# Altium schematic sheet 4v4 Power Supply.SchDoc: Power Supply
size A3
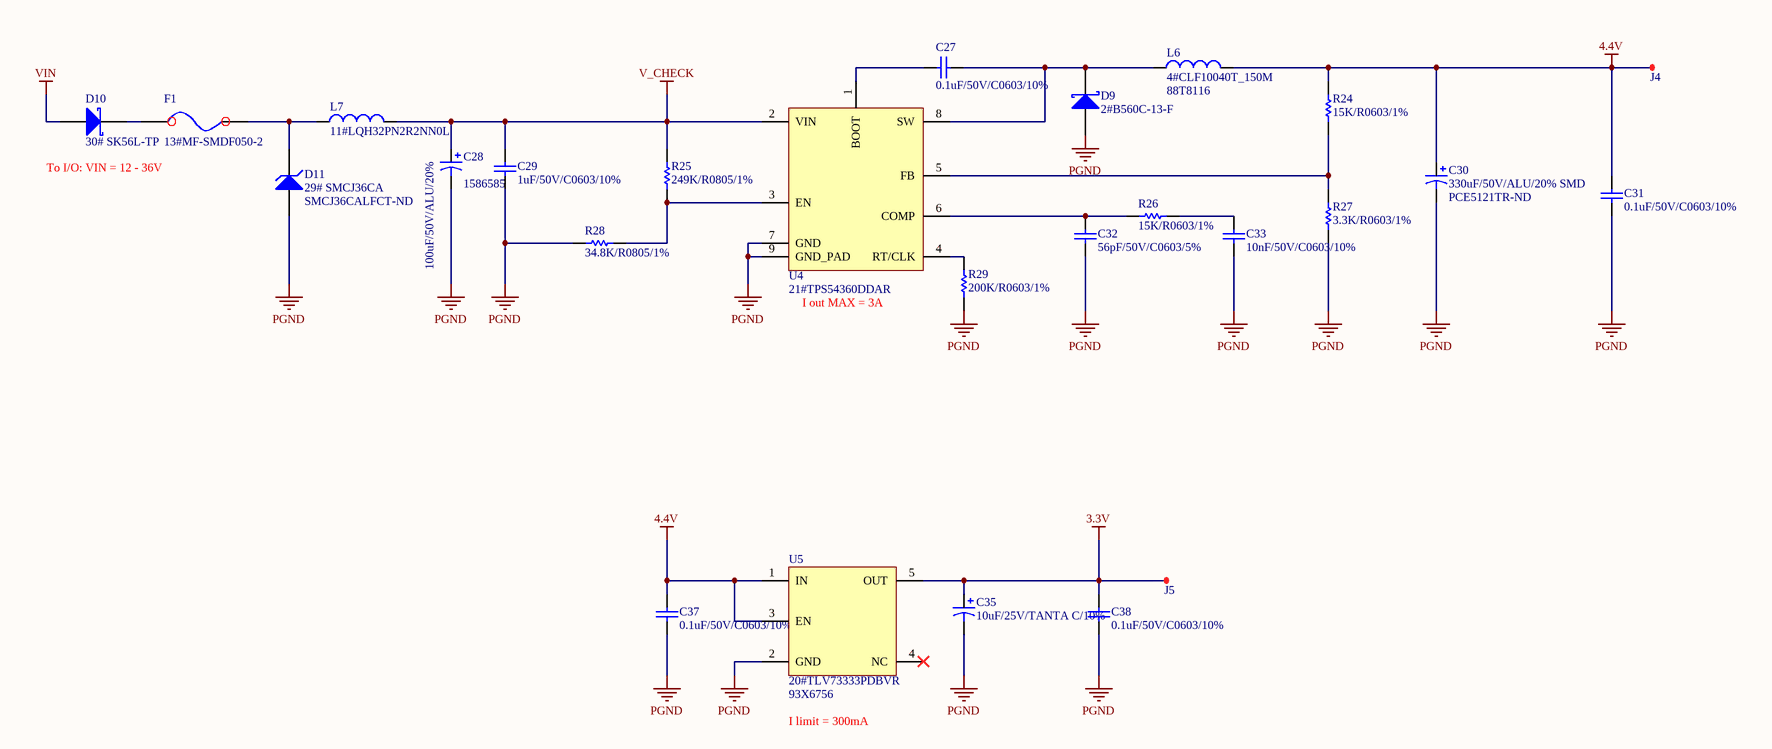
[diagram p0: 4v4 Power Supply.SchDoc]

## Parts
C27  0.1uF/50V/C0603/10%  [Cap Ceramic 0603 SMD]
C28  100uF/50V/ALU/20%  Supplier Part Number 1: 1586585  [CAP ALU CASE F SMD]
C29  1uF/50V/C0603/10%  [Cap Ceramic 0603 SMD]
C30  330uF/50V/ALU/20% SMD  Supplier Part Number 1: PCE5121TR-ND  [CAP ALU CASE G SMD]
C31  0.1uF/50V/C0603/10%  [Cap Ceramic 0603 SMD]
C32  56pF/50V/C0603/5%  [Cap Ceramic 0603 SMD]
C33  10nF/50V/C0603/10%  [Cap Ceramic 0603 SMD]
C35  10uF/25V/TANTA C/10%  [CAP TANT CASE C SMD]
C37  0.1uF/50V/C0603/10%  [Cap Ceramic 0603 SMD]
C38  0.1uF/50V/C0603/10%  [Cap Ceramic 0603 SMD]
D9  2#B560C-13-F  [2# B560C]
D10  30# SK56L-TP  [30# SK56L-TPMSCT-ND]
D11  29# SMCJ36CA  Supplier Part Number 1: SMCJ36CALFCT-ND  [29# diode SMCJ36A]
F1  13#MF-SMDF050-2  [13# MF-SMDF050]
J4  TEST POINT  [TEST POINT 1mm]  (value not drawn)
J5  TEST POINT  [TEST POINT 1mm]  (value not drawn)
L6  4#CLF10040T_150M  Supplier Part Number 1: 88T8116  [4# clf10040XX]
L7  11#LQH32PN2R2NN0L  [11# LQH32PN2R2]
R24  15K/R0603/1%  [Res 0603 SMD]
R25  249K/R0805/1%  [Res 0805 SMD]
R26  15K/R0603/1%  [Res 0603 SMD]
R27  3.3K/R0603/1%  [Cap Ceramic 0603 SMD]
R28  34.8K/R0805/1%  [Res 0805 SMD]
R29  200K/R0603/1%  [Res 0603 SMD]
U4  21#TPS54360DDAR  [21# TPS54360]
U5  20#TLV73333PDBVR  Supplier Part Number 1: 93X6756  [20# TLV73333PDBVR]

## Nets
3.3V: C35.1 C38.2 J5.1(TP) U5.5(OUT)
4.4V: C30.1 C31.2 C37.2 J4.1(TP) L6.2 R24.2 U5.1(IN) U5.3(EN)
PGND: C28.2 C29.1 C30.2 C31.1 C32.1 C33.1 C35.2 C37.1 C38.1 D9.1(A) D11.1(A) R27.1 R28.1 R29.2 U4.7(GND) U4.9(GND_PAD) U5.2(GND)
V_CHECK: C28.1 C29.2 L7.2 R25.2 U4.2(VIN)
VIN: D10.1(A)
NetC27_1: C27.1 U4.1(BOOT)
NetC27_2: C27.2 D9.2(K) L6.1 U4.8(SW)
NetC32_2: C32.2 R26.2 U4.6(COMP)
NetC33_2: C33.2 R26.1
NetD10_2: D10.2(K) F1.1(IN)
NetD11_2: D11.2(K) F1.2(OUT) L7.1
NetR24_1: R24.1 R27.2 U4.5(FB)
NetR25_1: R25.1 R28.2 U4.3(EN)
NetR29_1: R29.1 U4.4(RT/CLK)

Not connected (* = marked no-connect by the designer): U5 4(NC)*

## Notes on the sheet
- To I/O: VIN = 12 - 36V
- (near U4) I out MAX = 3A
- I limit = 300mA
- Title
- Size:
- Date:
- A3
- Number:
- Time:
- Revision:
- Sheet
- of
- File:

## Library data of the parts
C27 C31 C37 C38 = 0.1uF/50V/C0603/10%: CAP CER 0.1UF 50V 10% X7R 0603; Manufacturer: Murata Electronics North America; Manufacturer Part Number: GRM188R71H104KA93D; Capacitance: 0.1µF; RoHS: RoHS Compliant; Category: Capacitors; Packaging: Tape & Reel (TR); Tolerance: ±10%; Voltage - Rated: 50V; Temperature Coefficient: X7R; Mounting Type: Surface Mount, MLCC; Operating Temperature: -55°C ~ 125°C; Applications: General Purpose; Ratings: -; Package / Case: 0603 (1608 Metric); Size / Dimension: 0.063" L x 0.031" W (1.60mm x 0.80mm); Height - Seated (Max): -; Thickness (Max): 0.035" (0.90mm); Lead Spacing: -; Features: -; Lead Style: -; ComponentLink1URL: http://www.murata.com/~/media/webrenewal/support/library/catalog/products/capacitor/mlcc/c02e.ashx; ComponentLink1Description: http://www.murata.com/~/media/webrenewal/support/library/catalog/products/capacitor/mlcc/c02e.ashx; Supplier 1: Digi-Key; Supplier Part Number 1: 490-1519-1-ND
C28 = 100uF/50V/ALU 8X11.5/20%: CAP ALU 100UF 20% 50V RADIAL; Manufacturer: Panasonic Electronic Components; Manufacturer Part Number: ECA-1HM101B; Capacitance: 100µF; Lifetime @ Temp.: 2000 Hrs @ 85°C; Ripple Current: 250mA; RoHS: RoHS Compliant; Category: Capacitors; Packaging: Tape & Box (TB); Tolerance: ±20%; Voltage Rating: 50V; ESR (Equivalent Series Resistance): -; Operating Temperature: -40°C ~ 85°C; Type: -; Applications: General Purpose; Impedance: -; Lead Spacing: 0.197" (5.00mm); Size / Dimension: 0.315" Dia (8.00mm); Height - Seated (Max): 0.492" (12.50mm); Surface Mount Land Size: -; Mounting Type: Through Hole; Package / Case: Radial, Can; ComponentLink1URL: http://industrial.panasonic.com/www-cgi/jvcr13pz.cgi?E+PZ+3+ABA0012+ECA1HM101B+7+WW; ComponentLink1Description: http://industrial.panasonic.com/www-cgi/jvcr13pz.cgi?E+PZ+3+ABA0012+ECA1HM101B+7+WW; Supplier 1: Future Electronics
C29 = 1uF/50V/C0603/10%: CAP CER 1UF 50V X7R 0603; Manufacturer: Samsung Electro-Mechanics America, Inc.; Manufacturer Part Number: CL21B105KBFNNNE; Capacitance: 1µF; Tolerance: ±10%; RoHS: RoHS Compliant; Category: Capacitors; Packaging: Cut Tape (CT); Voltage - Rated: 50V; Temperature Coefficient: X7R; Mounting Type: Surface Mount, MLCC; Operating Temperature: -55°C ~ 125°C; Applications: General Purpose; Ratings: -; Package / Case: 0805 (2012 Metric); Size / Dimension: 0.079" L x 0.049" W (2.00mm x 1.25mm); Height - Seated (Max): -; Thickness (Max): 0.053" (1.35mm); Lead Spacing: -; Features: -; Lead Style: -; ComponentLink1URL: http://www.samsungsem.com/kr/support/product-search/mlcc/CL21B105KBFNNNE.jsp; ComponentLink1Description: http://www.samsungsem.com/kr/support/product-search/mlcc/CL21B105KBFNNNE.jsp; Supplier 1: Digi-Key; Supplier Part Number 1: 1276-1029-1-ND
C30 = 330uF/50V/ALU12.5X20mm/20%/7000Hrs: CAP ALU 330UF 20% 50V SMD; Manufacturer: Nichicon; Manufacturer Part Number: UPW1J331MHD; Lifetime @ Temp.: 7000 Hrs @ 105°C; Polarization: Polar; Ripple Current - Low Frequency: 838.5mA @ 120Hz; Ripple Current - High Frequency: 1.29A @ 100kHz; RoHS: RoHS Compliant; Category: Capacitors; Packaging: Bulk; Part Status: Active; Tolerance: ±20%; ESR (Equivalent Series Resistance): -; Operating Temperature: -55°C ~ 105°C; Applications: General Purpose; Lead Spacing: 0.197" (5.00mm); Size / Dimension: 0.492" Dia (12.50mm); Height - Seated (Max): 0.787" (20.00mm); Surface Mount Land Size: -; Mounting Type: Through Hole; Package / Case: Radial, Can; ComponentLink1URL: http://nichicon-us.com/english/products/pdfs/e-upw.pdf; ComponentLink1Description: http://nichicon-us.com/english/products/pdfs/e-upw.pdf; Supplier 1: Digi-Key
C32 = 56pF/50V/C0603/5%: Cap Ceramic 56pF 50V C0G 5% SMD 0603 125C Paper T/R; Manufacturer: Samsung; Manufacturer Part Number: CL10C560JB8NNNC; Temperature Coefficient: 30ppm/°C; Supplier 1: Digi-Key; Stock 1: 40000; Pricing 1: 1=0.1, 10=0.056, 100=0.0251, 500=0.0179, 1000=0.0141 (USD); Mount: Surface Mount; Case/Package: 0603; Case Code (Metric): 1608; Case Code (Imperial): 0603; Material: Ceramic; Min Operating Temperature: -55°C; Max Operating Temperature: 125°C; Capacitance: 56pF; Tolerance: 5%; Packaging: Tape and Reel; Voltage Rating: 50V; Package Quantity: 1; Dielectric: C0G; Voltage: 50V; Termination: SMD/SMT; Voltage Rating (DC): 50V; Length: 1.6mm; Height: 0.8mm; Width: 0.031inch; Thickness: 0.035inch; Depth: 0.8mm; Radiation Hardening: No; Lead Free: Lead Free; Supplier Part Number 1: 1276-1197-1-ND
C33 = 10nF/50V/C0603/10%: CAP CER 10000PF 50V X7R 0603; Manufacturer: Murata Electronics North America; Manufacturer Part Number: GRM188R71H103KA01D; Tolerance: ±10%; RoHS: RoHS Compliant; Category: Capacitors; Packaging: Cut Tape (CT); Capacitance: 10000pF; Voltage - Rated: 50V; Temperature Coefficient: X7R; Mounting Type: Surface Mount, MLCC; Operating Temperature: -55°C ~ 125°C; Applications: General Purpose; Ratings: -; Package / Case: 0603 (1608 Metric); Size / Dimension: 0.063" L x 0.031" W (1.60mm x 0.80mm); Height - Seated (Max): -; Thickness (Max): 0.035" (0.90mm); Lead Spacing: -; Features: -; Lead Style: -; ComponentLink1URL: http://www.murata.com/~/media/webrenewal/support/library/catalog/products/capacitor/mlcc/c02e.ashx; ComponentLink1Description: http://www.murata.com/~/media/webrenewal/support/library/catalog/products/capacitor/mlcc/c02e.ashx; Supplier 1: Digi-Key; Supplier Part Number 1: 490-1512-1-ND
C35 = TAJB106M025RNJ: Tantalum Capacitors - Solid SMD 25v 10uF 20%Tol Code C; Manufacturer: Kyocera AVX; Tolerance: 20%; ESR (Equivalent Series Resistance): 2.5R; Leakage Current: 2.5uA; Polarity: Polar; Dissipation Factor: 6%; Supplier 1: Digi-Key; Manufacturer Part Number: TAJB106M025RNJ; Stock 1: 10615; Pricing 1: 1=0.74, 10=0.524, 100=0.3453, 500=0.2558, 1000=0.2174 (USD); Mount: Surface Mount; Case/Package: 1210; Weight: 0.000564oz; Case Code (Metric): 3528; Case Code (Imperial): 1210; Min Operating Temperature: -55°C; Max Operating Temperature: 125°C; Packaging: Tape and Reel; Capacitance: 10uF; Voltage Rating: 25V; Package Quantity: 2000; Termination: SMD/SMT; Voltage Rating (DC): 25V; Features: General Purpose; Length: 3.5mm; Height: 2.1mm; Width: 0.11inch; Height - Seated (Max): 0.083inch; Depth: 2.8mm; Lead Free: Lead Free; Supplier Part Number 1: 478-8887-1-ND
D9 = 2#B560C-13-F: DIODE SCHOTTKY 60V 5A SMC; Manufacturer: Diodes; Peak Reverse Current: 500uA; Forward Voltage: 700mV; Max Forward Surge Current (Ifsm): 100A; Element Configuration: Single; Polarity: Standard; Capacitance: 300pF; Supplier 1: Digi-Key; Manufacturer Part Number: B560C-13-F; Stock 1: 183351; Pricing 1: 1=0.55, 10=0.467, 100=0.349, 500=0.2742, 1000=0.2119 (USD); Mount: Surface Mount; Case/Package: SMC; Number of Pins: 2; Weight: 0.007408oz; Contact Plating: Matte,Tin; Min Operating Temperature: -55°C; Max Operating Temperature: 125°C; Package Quantity: 3000; Packaging: Tape and Reel; Forward Current: 5A; Max Repetitive Reverse Voltage (Vrrm): 60V; Average Rectified Current: 5A; Peak Non-Repetitive Surge Current: 100A; Termination: SMD/SMT; Voltage Rating (DC): 60V; Current Rating: 5A; Output Current: 5A; Max Reverse Voltage (DC): 60V; Length: 7.11mm; Height: 2.5mm; Width: 6.22mm; Radiation Hardening: No; REACH SVHC: No SVHC; Lead Free: Lead Free; Supplier Part Number 1: B560C-FDICT-ND
D10 = 30# SK56L-TP: DIODE SCHOTTKY 60V 5A; Manufacturer: Micro Commercial Co; Voltage - Forward (Vf) (Max) @ If: 750mV @ 5A; Speed: Fast Recovery =< 500ns, > 200mA (Io); Current - Reverse Leakage @ Vr: 1mA @ 60V; Manufacturer Part Number: SK56L-TP; RoHS: RoHS Compliant; Category: Discrete Semiconductor Products; Packaging: Cut Tape (CT); Diode Type: Schottky; Voltage - DC Reverse (Vr) (Max): 60V; Current - Average Rectified (Io): 5A; Reverse Recovery Time (trr): -; Capacitance @ Vr, F: -; Mounting Type: Surface Mount; Package / Case: DO-214AB, SMC; Supplier Device Package: DO-214AB, (SMC); Operating Temperature - Junction: -55°C ~ 150°C; ComponentLink1URL: http://www.mccsemi.com/up_pdf/SK52L-SK510L(DO-214AB).PDF; ComponentLink1Description: http://www.mccsemi.com/up_pdf/SK52L-SK510L(DO-214AB).PDF; Supplier 1: Digi-Key; Supplier Part Number 1: SK56L-TPMSCT-ND
D11 = 29# SMCJ36CA: TVS DIODE 36VWM 58.1VC SMC; Manufacturer: Littelfuse; Direction: Bidirectional; Reverse Breakdown Voltage: 40V; Operating Supply Voltage: 36V; Max Surge Current: 25.9A; Number of Bidirectional Channels: 1; Clamping Voltage: 58.1V; Peak Pulse Power: 1.5kW; Power Line Protection: No; Test Current: 1mA; Max Breakdown Voltage: 44.2V; Max Power Dissipation: 6.5W; Leakage Current: 1uA; Supplier 1: Digi-Key; Manufacturer Part Number: SMCJ36CA; Stock 1: 75326; Pricing 1: 1=0.7, 10=0.587, 25=0.514, 100=0.4406, 250=0.3818, 500=0.3231, 1000=0.2497 (USD); Mount: Surface Mount; Number of Pins: 2; Min Operating Temperature: -55°C; Max Operating Temperature: 150°C; Package Quantity: 3000; Packaging: Tape and Reel; Reverse Standoff Voltage: 36V; Min Breakdown Voltage: 40V; Breakdown Voltage: 40V; Number of Channels: 1; Polarity: Bidirectional; Termination: SMD/SMT; Number of Elements: 1; Peak Pulse Current: 25.9A; Power Dissipation: 1.5kW; Voltage Rating (DC): 36V; Composition: Zener; Length: 8.13mm; Height: 2.62mm; Width: 6.22mm; Radiation Hardening: No; REACH SVHC: No SVHC; Lead Free: Lead Free
F1 = 13#MF-SMDF050-2: PTC RESETTABLE .55A 60V 2018; Manufacturer: Bourns; Current Rating: 10A; Resistance: 1R; Power Dissipation: 900mW; Hold Current: 550mA; Trip Current: 1.2A; Time to Trip: 3s; Approvals: CSA,TUV,UL; Supplier 1: Digi-Key; Manufacturer Part Number: MF-SMDF050-2; Stock 1: 235849; Pricing 1: 1=0.46, 5=0.446, 10=0.433, 50=0.3644, 100=0.3025, 250=0.275, 500=0.2338, 1000=0.2063 (USD); Mount: PCB,Surface Mount; Case/Package: 2018; Case Code (Metric): 5045; Number of Terminals: 2; Case Code (Imperial): 2018; Contact Plating: Gold; Terminal Material: Gold; Min Operating Temperature: -40°C; Max Operating Temperature: 85°C; Package Quantity: 6000; Packaging: Tape and Reel; Max Current Rating: 10A; Voltage Rating: 60V; Operating Supply Voltage: 60V; Termination: SMD/SMT; Voltage Rating (DC): 60V; Length: 5.44mm; Height: 1.09mm; Width: 4.93mm; Radiation Hardening: No; REACH SVHC: Unknown; Lead Free: Lead Free; Supplier Part Number 1: MF-SMDF050-2CT-ND
J4 J5 = PAD 1mm: TPoint
L6 = 4#CLF10040T_150M: FIXED IND 15uH 3.2A 40 MOHM (10.0×9.7×3.8); Supplier 1: Newark
L7 = 11#LQH32PN2R2NN0L: Inductor Power Chip Shielded Wirewound 2.2uH 30% 1MHz Ferrite 1.6A 91.2mOhm DCR 1210 Embossed T/R; Manufacturer: Murata; Self Resonant Frequency: 70MHz; Saturation Current: 1.55A; DC Resistance (DCR): 76mR; Supplier 1: Digi-Key; Manufacturer Part Number: LQH32PN2R2NN0L; Stock 1: 21482; Pricing 1: 1=0.41, 10=0.361, 100=0.2483, 500=0.2122, 1000=0.1625 (USD); Mount: Surface Mount; Case/Package: 1210; Weight: 0.001552oz; Core Material: Ferrite; Case Code (Metric): 3225; Case Code (Imperial): 1210; Min Operating Temperature: -40°C; Max Operating Temperature: 85°C; Tolerance: 30%; Packaging: Tape and Reel; Shielding: Shielded; Package Quantity: 1; Current Rating: 1.6A; Inductance: 2.2uh; Max DC Current: 1.55A; Termination: SMD/SMT; Composition: Wirewound; Test Frequency: 1MHz; DC Current: 1.6A; Military Standard: Not; Inductance Tolerance: 30%; Length: 3.2mm; Height: 2mm; Width: 2.5mm; Height - Seated (Max): 0.067inch; Depth: 2.8mm; Radiation Hardening: No; REACH SVHC: No SVHC; Lead Free: Lead Free; Supplier Part Number 1: 490-5336-1-ND
R24 R26 = 15K/R0603/1%: RES SMD 15K OHM 1% 1/10W 0603; Manufacturer: Yageo; Manufacturer Part Number: RC0603FR-0715KL; Power (Watts): 0.1W, 1/10W; Temperature Coefficient: ±100ppm/°C; RoHS: RoHS Compliant; Category: Resistors; Packaging: Digi-Reel®; Resistance (Ohms): 15k; Tolerance: ±1%; Composition: Thick Film; Features: Moisture Resistant; Operating Temperature: -55°C ~ 155°C; Package / Case: 0603 (1608 Metric); Supplier Device Package: 0603; Size / Dimension: 0.063" L x 0.031" W (1.60mm x 0.80mm); Height: 0.022" (0.55mm); Number of Terminations: 2; ComponentLink1URL: http://www.yageo.com/NewPortal/yageodocoutput?fileName=/pdf/R-Chip/PYu-RC_Group_51_RoHS_L_3.pdf; ComponentLink1Description: http://www.yageo.com/NewPortal/yageodocoutput?fileName=/pdf/R-Chip/PYu-RC_Group_51_RoHS_L_3.pdf; Supplier 1: Digi-Key; Supplier Part Number 1: 311-15.0KHRCT-ND
R25 = 249K/R0805/1%: RES SMD 249K OHM 1% 1/10W 0805; Manufacturer: Yageo; Manufacturer Part Number: RC0603FR-07249KL; Power (Watts): 0.1W, 1/10W; Temperature Coefficient: ±100ppm/°C; Supplier 1: Digi-Key; RoHS: RoHS Compliant; Category: Resistors; Stock 1: 370515; Pricing 1: 1=0.1, 10=0.015, 100=0.006, 1000=0.00268, 2500=0.00233 (USD); Packaging: Cut Tape (CT); Part Status: Active; Tolerance: ±1%; Composition: Thick Film; Features: Moisture Resistant; Operating Temperature: -55°C ~ 155°C; Package / Case: 0603 (1608 Metric); Supplier Device Package: 0603; Size / Dimension: 0.063" L x 0.032" W (1.60mm x 0.80mm); Height - Seated (Max): 0.022" (0.55mm); Failure Rate: -; ComponentLink1URL: http://www.yageo.com/documents/recent/PYu-RC_Group_51_RoHS_L_8.pdf; ComponentLink1Description: http://www.yageo.com/documents/recent/PYu-RC_Group_51_RoHS_L_8.pdf
R27 = 3.3K/R0603/1%: RES SMD 3.3K OHM 1% 1/10W 0603; Manufacturer: Yageo; Manufacturer Part Number: RC0603FR-073K3L; Power (Watts): 0.1W, 1/10W; Temperature Coefficient: ±100ppm/°C; RoHS: RoHS Compliant; Category: Resistors; Packaging: Digi-Reel®; Resistance (Ohms): 3.3k; Tolerance: ±1%; Composition: Thick Film; Features: Moisture Resistant; Operating Temperature: -55°C ~ 155°C; Package / Case: 0603 (1608 Metric); Supplier Device Package: 0603; Size / Dimension: 0.063" L x 0.031" W (1.60mm x 0.80mm); Height: 0.022" (0.55mm); Number of Terminations: 2; ComponentLink1URL: http://www.yageo.com/NewPortal/yageodocoutput?fileName=/pdf/R-Chip/PYu-RC_Group_51_RoHS_L_3.pdf; ComponentLink1Description: http://www.yageo.com/NewPortal/yageodocoutput?fileName=/pdf/R-Chip/PYu-RC_Group_51_RoHS_L_3.pdf; Supplier 1: Digi-Key; Supplier Part Number 1: 311-3.30KHRCT-ND
R28 = 34.8K/R0805/1%: Thick Film Resistors - SMD 34.8K OHM 1% 0805; Manufacturer: Yageo; Manufacturer Part Number: RC0603FR-0734K8L; Power Rating: 100mW; Resistance: 34.8kR; Voltage Rating: 50V; Temperature Coefficient: 100ppm/°C; Supplier 1: Digi-Key; Stock 1: 82861; Pricing 1: 1=0.1, 10=0.026, 100=0.0107, 1000=0.0048, 2500=0.0042 (USD); Case/Package: 0603; Case Code (Imperial): 0603; Case Code (Metric): 1608; Min Operating Temperature: -55°C; Max Operating Temperature: 155°C; Tolerance: 1%; Packaging: Tape and Reel; Termination: SMD/SMT; Composition: Thick Film; Military Standard: Not; Voltage Rating (DC): 50V; Length: 1.6mm; Height: 0.45mm; Width: 0.8mm; Depth: 0.8mm; Lead Free: Lead Free; Supplier Part Number 1: 311-34.8KHRCT-ND
R29 = 200K/R0603/1%: RES SMD 200K OHM 1% 1/10W 0603; Manufacturer: Yageo; Manufacturer Part Number: RC0603FR-07200KL; Power (Watts): 0.1W, 1/10W; Temperature Coefficient: ±100ppm/°C; Supplier 1: Digi-Key; RoHS: RoHS Compliant; Category: Resistors; Stock 1: 924437; Pricing 1: 1=0.1, 10=0.015, 100=0.006, 1000=0.00268, 2500=0.00233 (USD); Packaging: Cut Tape (CT); Part Status: Active; Tolerance: ±1%; Composition: Thick Film; Features: Moisture Resistant; Operating Temperature: -55°C ~ 155°C; Package / Case: 0603 (1608 Metric); Supplier Device Package: 0603; Size / Dimension: 0.063" L x 0.031" W (1.60mm x 0.80mm); Height - Seated (Max): 0.022" (0.55mm); Failure Rate: -; ComponentLink1URL: http://www.yageo.com/documents/recent/PYu-RC_Group_51_RoHS_L_7.pdf; ComponentLink1Description: http://www.yageo.com/documents/recent/PYu-RC_Group_51_RoHS_L_7.pdf; Supplier Part Number 1: 311-200KHRCT-ND
U4 = 21#TPS54360DDAR: Voltage Regulators - Switching Regulators 60 Vin,3.5 A,SD DC-DC Converter; Manufacturer: Texas Instruments; Output Current: 3.5A; Min Input Voltage: 4.5V; Number of Outputs: 1; Max Input Voltage: 60V; Output Voltage: 58.8V; Switching Frequency: 2.5MHz; Synchronous Rectifier: Yes; Min Output Voltage: 800mV; Quiescent Current: 146uA; Output Type: Adjustable; Output Configuration: Positive; Supplier 1: Digi-Key; Manufacturer Part Number: TPS54360DDAR; Stock 1: 40955; Pricing 1: 1=4.32, 10=3.883, 100=3.1815, 500=2.7083, 1000=2.2841 (USD); Mount: Surface Mount; Number of Pins: 8; Contact Plating: Gold; Min Operating Temperature: -40°C; Max Operating Temperature: 125°C; Packaging: Tape and Reel; Package Quantity: 2500; Max Output Current: 3.5A; Max Output Voltage: 58.8V; Operating Supply Voltage: 60V; Radiation Hardening: No; REACH SVHC: No SVHC; Lead Free: Lead Free; Supplier Part Number 1: 296-37676-1-ND; Case/Package: DDA R-PDSO-G8
U5 = 20#TLV73333PDBVR: LDO Regulator Pos 3.3V 0.3A 5-Pin SOT-23 T/R; Manufacturer: Texas Instruments; Number of Outputs: 1; Min Input Voltage: 1.4V; Max Input Voltage: 5.5V; Max Output Current: 300mA; Dropout Voltage: 125mV; Min Current Limit: 360mA; Polarity: Positive; Quiescent Current: 60uA; Accuracy: 1%; Output Type: Fixed; Manufacturer Part Number: TLV73333PDBVR; Mount: Surface Mount; Case/Package: SOT-23-5; Number of Pins: 5; Weight: 0.000557oz; Contact Plating: Gold; Min Operating Temperature: -40°C; Max Operating Temperature: 125°C; Packaging: Tape and Reel; Output Voltage: 3.3V; Output Current: 300mA; Number of Regulators: 1; Package Quantity: 3000; Radiation Hardening: No; Lead Free: Lead Free; Supplier 1: Newark